# EAGLE design water-sensor (EAGLE 7.5.0)
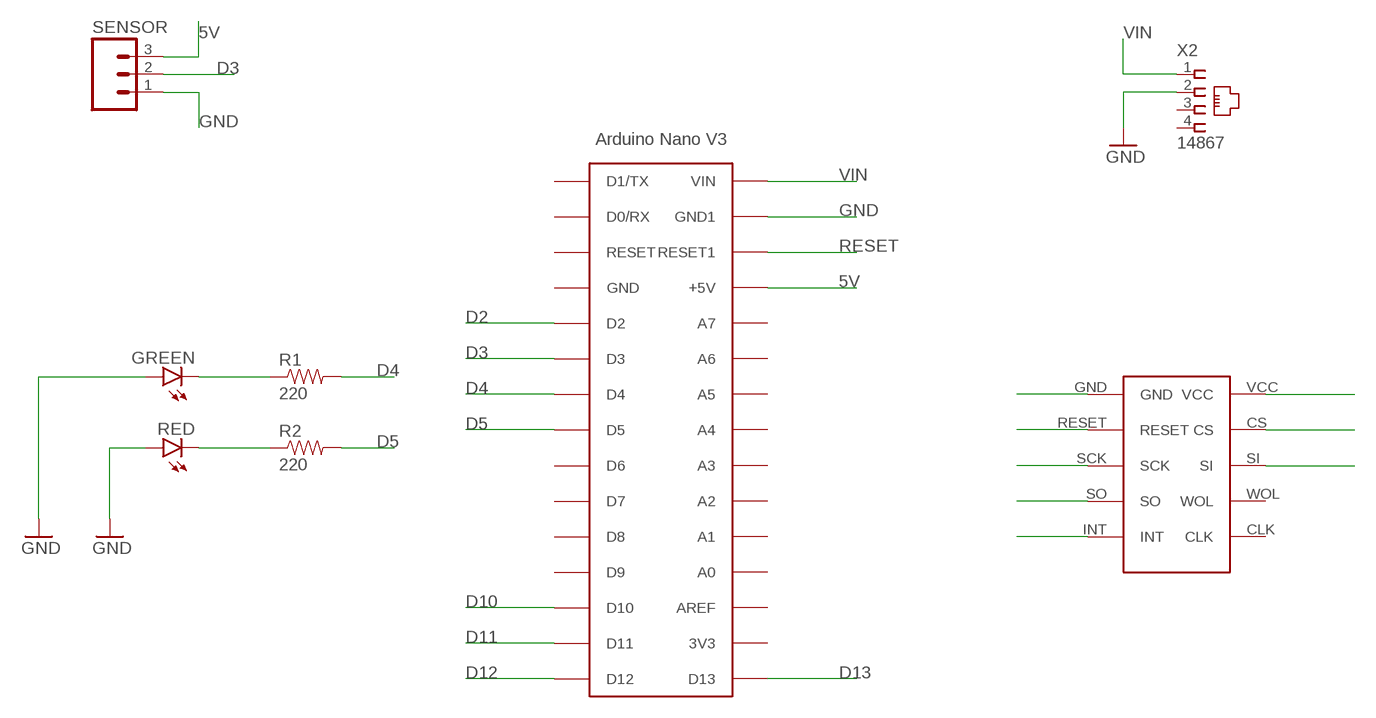
[diagram p0: schematic, sheet 1]

## Parts
GREEN  LED3MM  [LED3MM]
R1  220  RESISTORPTH-1/2W  [AXIAL-0.5]
R2  220  RESISTORPTH-1/2W  [AXIAL-0.5]
RED  LED3MM  [LED3MM]
SENSOR  M03LONGPADS  [1X03_LONGPADS]
U$1  ARDUINONANO  [PDIP-32]
U$2  ENC28J60ENC28J60  [ENC28J60]
X2  14867  [14867]

## Nets
5V: SENSOR.3 U$1.+5V U$2.VCC
D2: U$1.D2 U$2.INT
D3: SENSOR.2 U$1.D3
D4: R1.P$2 U$1.D4
D5: R2.P$2 U$1.D5
D10: U$1.D10 U$2.CS
D11: U$1.D11 U$2.SI
D12: U$1.D12 U$2.SO
D13: U$1.D13 U$2.SCK
GND: GREEN.A RED.A SENSOR.1 U$1.GND1 U$2.GND X2.2
N$1: GREEN.K(C) R1.P$1
N$2: R2.P$1 RED.K(C)
RESET: U$1.RESET1 U$2.RESET
VIN: U$1.VIN X2.1
Unconnected: U$1.3V3 U$1.A0(A7) U$1.A1(A6) U$1.A2(A5) U$1.A3(A4) U$1.A4(A3) U$1.A5(A2) U$1.A6(A1) U$1.A7(A0) U$1.AREF U$1.D0/RX U$1.D1/TX U$1.D6 U$1.D7 U$1.D8 U$1.D9 U$1.GND U$1.RESET U$2.CLK U$2.WOL X2.3 X2.4

## Library data of the parts
GREEN RED = SparkFun-LED:LED: LEDs Standard schematic elements and footprints for 5mm, 3mm, 1206, and 0603 sized LEDs. 5mm - Spark Fun Electronics SKU : COM-00529 (and others); PROD_ID: DIO-08794
R1 R2 = SparkFun-Passives:RESISTOR: Resistor Basic schematic elements and footprints for 0603, 1206, and PTH resistors.
SENSOR = SparkFun-Connectors:M03: Header 3 Standard 3-pin 0.1" header. Use with straight break away headers (SKU : PRT-00116), right angle break away headers (PRT-00553), swiss pins (PRT-00743), machine pins (PRT-00117), and female headers (PRT-00115). Molex polarized connector foot print use with SKU : PRT-08232 with associated crimp pins and housings.
U$1 = CRE-Lib1:ARDUINONANO: Arduino Nano
U$2 = enc28j60:ENC28J60
X2 = con-4ucon:14867: RJ11 Connector Source: 4UCON TECHNOLOGY INC. 14867.pdf; OC_FARNELL: unknown; OC_NEWARK: unknown

## Net classes
0 default: width 1.27 mm

## Board
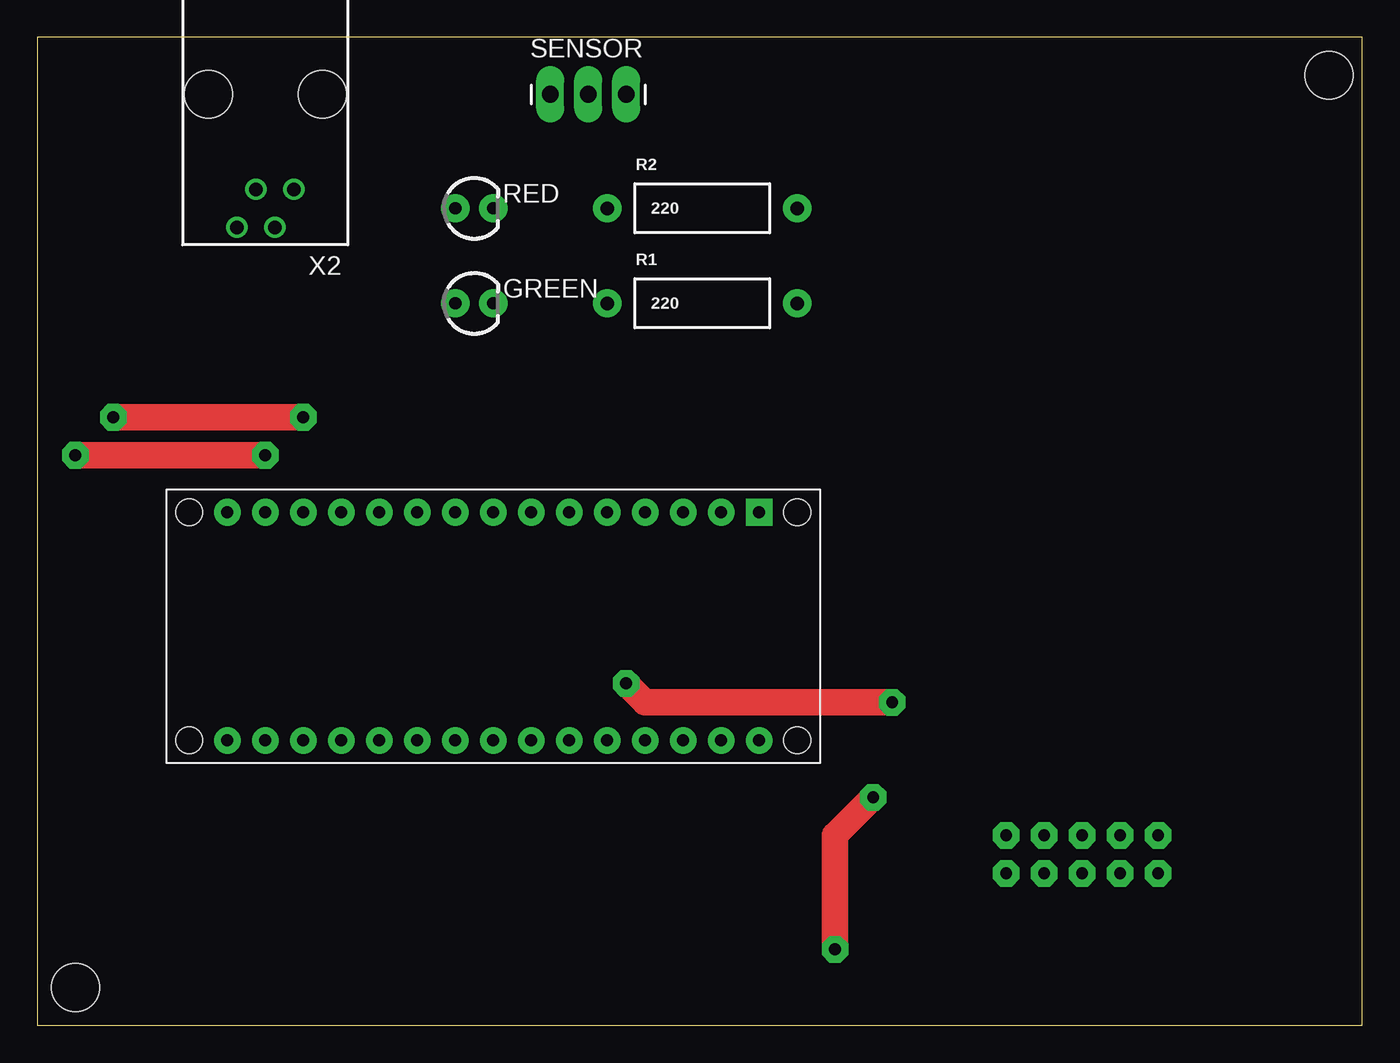
[diagram p1: board, top side]
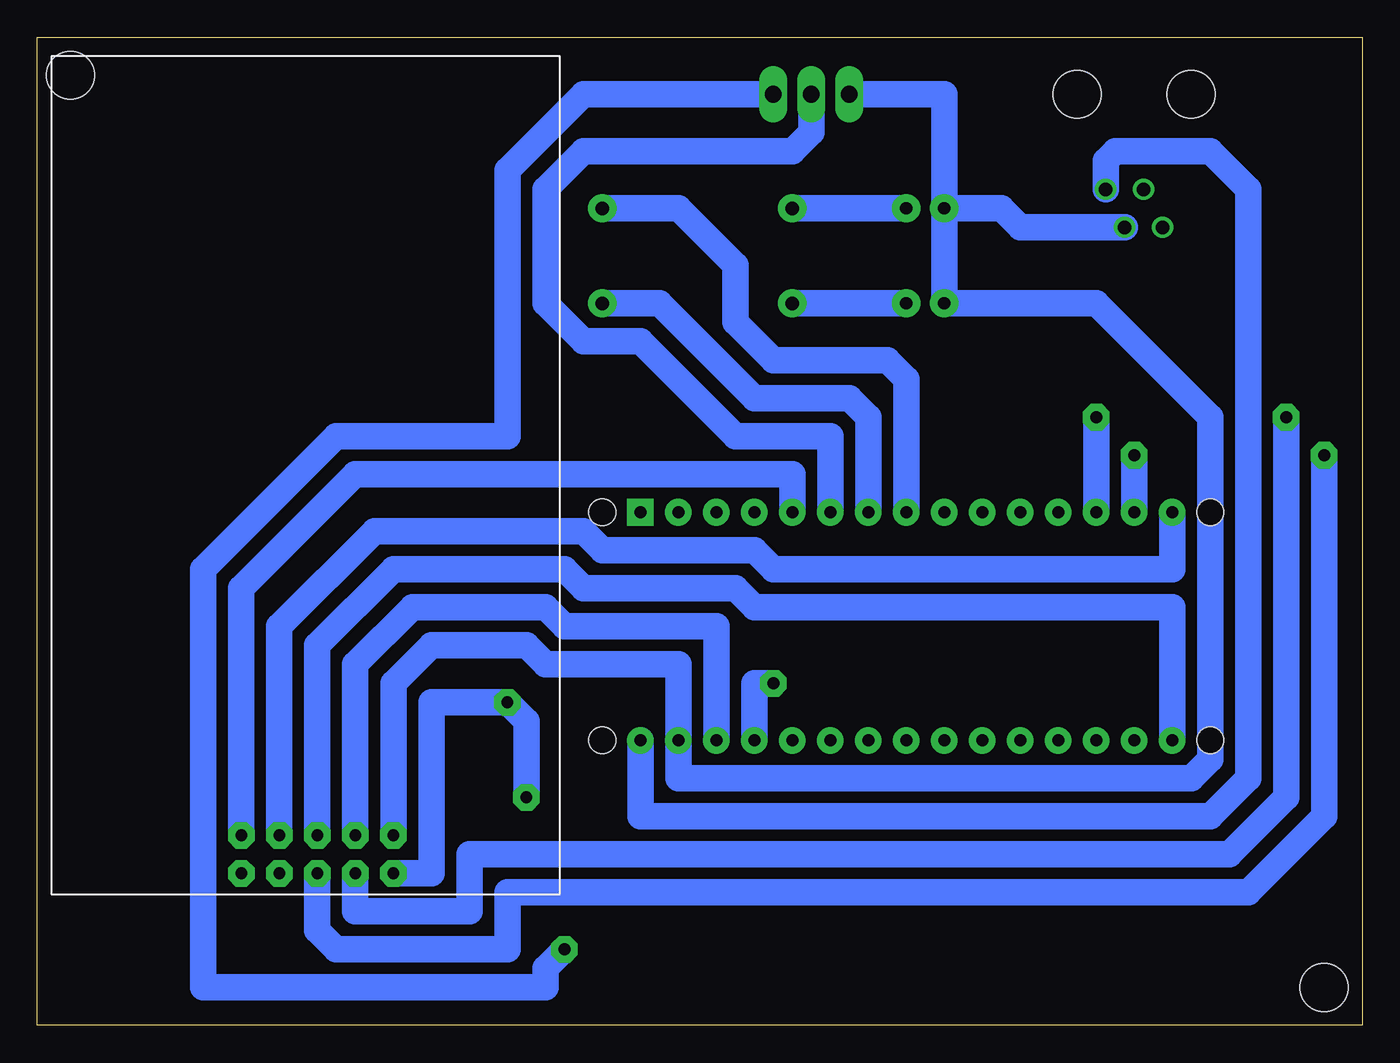
[diagram p2: board, bottom side, seen from below]

Size 88.57 x 66.03 mm. Coordinates in mm from the lower left corner, seen from the top.
Outline: 0,0 88.57,0 88.57,66.03 0,66.03 0,0
Copper layers (1*16): Top 0.035mm / dielectric 1.5mm / Bottom 0.035mm
Design rules "default": minimum track width 10mil, minimum drill 24mil, track to track 8mil, track to pad 8mil, pad to pad 8mil, via to via 8mil, smd to smd 8mil, copper to edge 40mil, drill to drill 8mil, minimum pad ring 10mil, minimum via ring 8mil, stop-mask expansion 4mil, vias tented up to drill 0mil, thermal gap 10mil
Holes 3.2 mm at 2.54,2.54 86.36,63.5

### Footprints (pad centres in the part's own frame; a part is rotated, then mirrored left to right if it is on the bottom)
LED3MM = drill 0.813 pad 1.88: A -1.27,0; K 1.27,0
AXIAL-0.5 = drill 0.9 pad 1.88: P$1 -6.35,0; P$2 6.35,0
1X03_LONGPADS = drill 1.118 pad 1.88 long: 1 0,0; 2 2.54,0; 3 5.08,0
PDIP-32 = drill 0.8 pad 1.778: 3V3 15.24,-35.56; +5V 15.24,-10.16; A0 15.24,-12.7; A1 15.24,-15.24; A2 15.24,-17.78; A3 15.24,-20.32; A4 15.24,-22.86; A5 15.24,-25.4; A6 15.24,-27.94; A7 15.24,-30.48; AREF 15.24,-33.02; D0/RX 0,-5.08; D2 0,-12.7; D3 0,-15.24; D4 0,-17.78; D5 0,-20.32; D6 0,-22.86; D7 0,-25.4; D8 0,-27.94; D9 0,-30.48; D10 0,-33.02; D11 0,-35.56; D12 0,-38.1; D13 15.24,-38.1; GND 0,-10.16; GND1 15.24,-5.08; RESET 0,-7.62; RESET1 15.24,-7.62; VIN 15.24,-2.54 | drill 0.8 pad 1.778 square: D1/TX 0,-2.54 | hole 1.778: 0,0; 0,-40.64; 15.24,-40.64; 15.24,0
ENC28J60 = drill 0.8 pad 1.778 octagon: CLK 54.61,12.7; CS 54.61,20.32; GND 52.07,22.86; INT 52.07,12.7; RESET 52.07,20.32; SCK 52.07,17.78; SI 54.61,17.78; SO 52.07,15.24; VCC 54.61,22.86; WOL 54.61,15.24
14867 = drill 0.9 pad 1.422: 1 -1.905,6.35; 2 -0.635,8.89; 3 0.635,6.35; 4 1.905,8.89 | hole 3.2: -3.81,0; 3.81,0

### Placement (x,y rotation side)
GREEN  29.21,48.26 0 top
R1  44.45,48.26 0 top
R2  44.45,54.61 0 top
RED  29.21,54.61 0 top
SENSOR  34.29,62.23 0 top
U$1  50.8,34.29 270 top
U$2  87.63,64.77 270 bottom
X2  15.24,62.23 180 top

### Tracks (layer width: path | path; a pad name or v marks a point on that pad's centre or on a via)
5V  (via drill 0.8 pad 1.78)
  Top 1.778: v57.15,21.59 40.64,21.59 v39.37,22.86 | v53.34,5.08 53.34,12.7 v55.88,15.24
  Bottom 1.778: U$2.VCC 62.23,10.16 62.23,21.59 v57.15,21.59 55.88,20.32 v55.88,15.24 | v39.37,22.86 40.64,22.86 U$1.+5V | SENSOR.3 52.07,62.23 57.15,57.15 57.15,39.37 68.58,39.37 77.47,30.48 77.47,2.54 54.61,2.54 54.61,3.81 v53.34,5.08
D2
  Bottom 1.778: U$2.INT 74.93,29.21 67.31,36.83 38.1,36.83 U$1.D2
D3
  Bottom 1.778: SENSOR.2 36.83,59.69 38.1,58.42 52.07,58.42 54.61,55.88 54.61,48.26 52.07,45.72 48.26,45.72 41.91,39.37 35.56,39.37 U$1.D3
D4
  Bottom 1.778: R1.P$2 46.99,48.26 40.64,41.91 34.29,41.91 33.02,40.64 U$1.D4
D5
  Bottom 1.778: R2.P$2 45.72,54.61 41.91,50.8 41.91,46.99 39.37,44.45 31.75,44.45 30.48,43.18 U$1.D5
D10  (via drill 0.8 pad 1.78)
  Top 1.778: v5.08,40.64 v17.78,40.64
  Bottom 1.778: U$2.CS 67.31,7.62 59.69,7.62 59.69,11.43 8.89,11.43 5.08,15.24 v5.08,40.64 | v17.78,40.64 U$1.D10
D11  (via drill 0.8 pad 1.78)
  Top 1.778: v2.54,38.1 v15.24,38.1
  Bottom 1.778: U$2.SI 69.85,6.35 68.58,5.08 57.15,5.08 57.15,8.89 7.62,8.89 2.54,13.97 v2.54,38.1 | v15.24,38.1 U$1.D11
D12
  Bottom 1.778: U$2.SO 72.39,26.67 66.04,33.02 52.07,33.02 50.8,31.75 40.64,31.75 39.37,30.48 12.7,30.48 U$1.D12
D13
  Bottom 1.778: U$2.SCK 69.85,25.4 64.77,30.48 53.34,30.48 52.07,29.21 41.91,29.21 40.64,27.94 12.7,27.94 U$1.D13
GND
  Bottom 1.778: SENSOR.1 27.94,62.23 RED.A | RED.A GREEN.A 17.78,48.26 10.16,40.64 10.16,17.78 11.43,16.51 45.72,16.51 U$1.GND1 45.72,24.13 54.61,24.13 55.88,25.4 62.23,25.4 64.77,22.86 U$2.GND | RED.A 24.13,54.61 22.86,53.34 X2.2
N$1
  Bottom 1.778: GREEN.K R1.P$1
N$2
  Bottom 1.778: RED.K R2.P$1
RESET
  Bottom 1.778: U$2.RESET 67.31,24.13 63.5,27.94 54.61,27.94 53.34,26.67 43.18,26.67 U$1.RESET1
VIN
  Bottom 1.778: X2.1 17.14,57.78 16.51,58.42 10.16,58.42 7.62,55.88 7.62,16.51 10.16,13.97 48.26,13.97 U$1.VIN